# Altium project gravador.PrjPCB
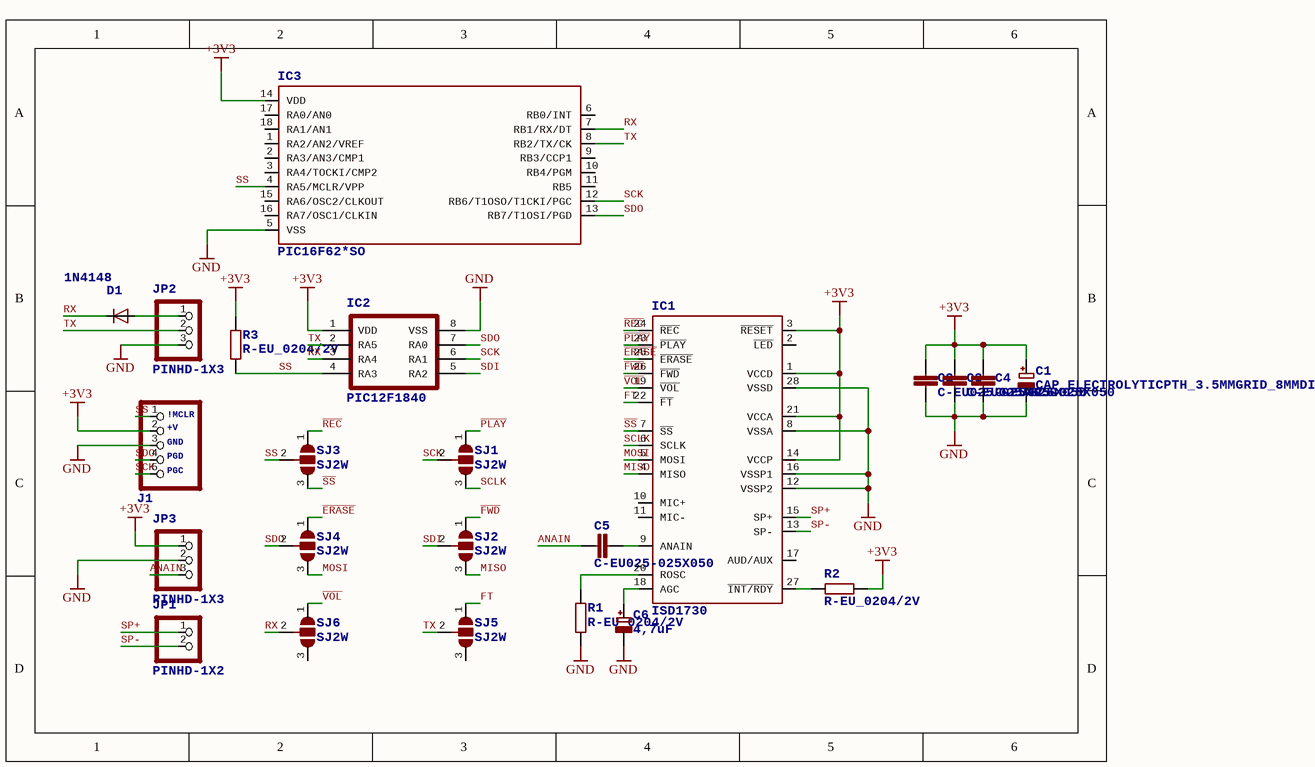
[diagram p0: gravador.SchDoc]
1 sheet, 23 parts. Net scope: global (net labels, ports and power ports of the same name join across sheets).

## Sheet gravador.SchDoc
size 194 x 131 mm

### Parts
C1  CAP_ELECTROLYTICPTH_3.5MMGRID_8MMDIA  [CELEC_3.5MM_8MM]
C2  C-EU025-025X050  [C025-025X050]
C3  C-EU025-025X050  [C025-025X050]
C4  C-EU025-025X050  [C025-025X050]
C5  C-EU025-025X050  [C025-025X050]
C6  4,7uF  [CELEC_3.5MM_8MM]
D1  1N4148  [DO35-7]
IC1  ISD1730  [SOP28_300MIL]
IC2  PIC12F1840  [DFN6_3X3]
IC3  PIC16F62*SO  [SO-18W]
J1  CON_HEADER_PRG_PIC_ICSP0.1INCH_B  [HEADER_PRG_1X05_ICSP_B]  (value not drawn)
JP1  PINHD-1X2  [1X02]
JP2  PINHD-1X3  [1X03]
JP3  PINHD-1X3  [1X03]
R1  R-EU_0204/2V  [0204V]
R2  R-EU_0204/2V  [0204V]
R3  R-EU_0204/2V  [0204V]
SJ1  SJ2W  [SJ_2]
SJ2  SJ2W  [SJ_2]
SJ3  SJ2W  [SJ_2]
SJ4  SJ2W  [SJ_2]
SJ5  SJ2W  [SJ_2]
SJ6  SJ2W  [SJ_2]

### Nets
+3V3: C1.+ C2.1 C3.1 C4.1 IC1.1(VCCD) IC1.3(~{RESET}) IC1.14(VCCP) IC1.21(VCCA) IC2.1(VDD) IC3.14(VDD) J1.2(+V) JP3.1 R2.1 R3.1
GND: C1.- C2.2 C3.2 C4.2 C6.- IC1.8(VSSA) IC1.12(VSSP2) IC1.16(VSSP1) IC1.28(VSSD) IC2.8(VSS) IC3.5(VSS) J1.3(GND) JP2.3 JP3.2 R1.1
ANAIN: C5.1 JP3.3
~{ERASE}: IC1.25(~{ERASE}) SJ4.1
~{FWD}: IC1.26(~{FWD}) SJ2.1
FT: IC1.22(~{FT}) SJ5.1
MISO: IC1.4(MISO) SJ2.3
MOSI: IC1.5(MOSI) SJ4.3
~{PLAY}: IC1.23(~{PLAY}) SJ1.1
~{REC}: IC1.24(~{REC}) SJ3.1
RX: D1.C IC2.3(RA4) IC3.7(RB1/RX/DT) SJ6.2
~{SS}: IC1.7(~{SS}) SJ3.3
SCK: IC2.6(RA1) IC3.12(RB6/T1OSO/T1CKI/PGC) J1.5(PGC) SJ1.2
SCLK: IC1.6(SCLK) SJ1.3
SDI: IC2.5(RA2) SJ2.2
SDO: IC2.7(RA0) IC3.13(RB7/T1OSI/PGD) J1.4(PGD) SJ4.2
SP+: IC1.15(SP+) JP1.1
SP-: IC1.13(SP-) JP1.2
SS: IC2.4(RA3) IC3.4(RA5/MCLR/VPP) J1.1(/MCLR) R3.2 SJ3.2
TX: IC2.2(RA5) IC3.8(RB2/TX/CK) JP2.2 SJ5.2
~{VOL}: IC1.19(~{VOL}) SJ6.1
NetC5_2: C5.2 IC1.9(ANAIN)
NetC6_+: C6.+ IC1.18(AGC)
NetD1_A: D1.A JP2.1
NetIC1_20: IC1.20(ROSC) R1.2
NetIC1_27: IC1.27(~{INT/RDY}) R2.2

Not connected (* = marked no-connect by the designer): IC1 2(~{LED}) 10(MIC+) 11(MIC-) 17(AUD/AUX); IC3 1(RA2/AN2/VREF) 2(RA3/AN3/CMP1) 3(RA4/TOCKI/CMP2) 6(RB0/INT) 9(RB3/CCP1) 10(RB4/PGM) 11(RB5) 15(RA6/OSC2/CLKOUT) 16(RA7/OSC1/CLKIN) 17(RA0/AN0) 18(RA1/AN1); SJ5 3; SJ6 3

### Library data of the parts
C1 C6 = CAP_ELECTROLYTICPTH_3.5MMGRID_8MMDIA: Electrolytic Capacitors   SMTPANASONIC_C - Size C Panasonic Electrolytic Aluminum Capacitor  47ÂµF 16V 20% Electrolytic Capacitor [Digikey: PCE3890TR-ND]    PANASONIC_D - Size D Panasonic Electrolytic Aluminum Capacitor  100ÂµF 25V 20% Electrolytic Capacitor [Digikey: PCE3898TR-ND]       PTH3.5 mm grid, 8 mm diameter ...    3.5 mm grid, 10 mm diameter ...
C2-C5 = C-EU025-025X050: CAPACITOR, European symbol
D1 = 1N4148DO35-7: DIODE   high speed (Philips)
IC2 = IC_UC_PIC12F1822DFN6_3X3
IC3 = PIC16F62*SO: FLASH-Based 8-Bit CMOS Microcontroller   Source: http://ww1.microchip.com/downloads/en/DeviceDoc/40300C.pdf; MPN: PIC16F627-04I/SO; MF: MICROCHIP; OC_FARNELL: 9760296; OC_NEWARK: 19C7271
J1 = CON_HEADER_PRG_PIC_ICSP0.1INCH_B: 5-pin PIC In Circuit Serial Programming header; !MCLR: !MCLR; +V: +V; GND: GND; PGD: PGD; PGC: PGC
JP1 = PINHD-1X2: PIN HEADER
JP2 JP3 = PINHD-1X3: PIN HEADER
R1-R3 = R-EU_0204/2V: RESISTOR, European symbol
SJ1-SJ6 = SJ2W: SMD solder JUMPER